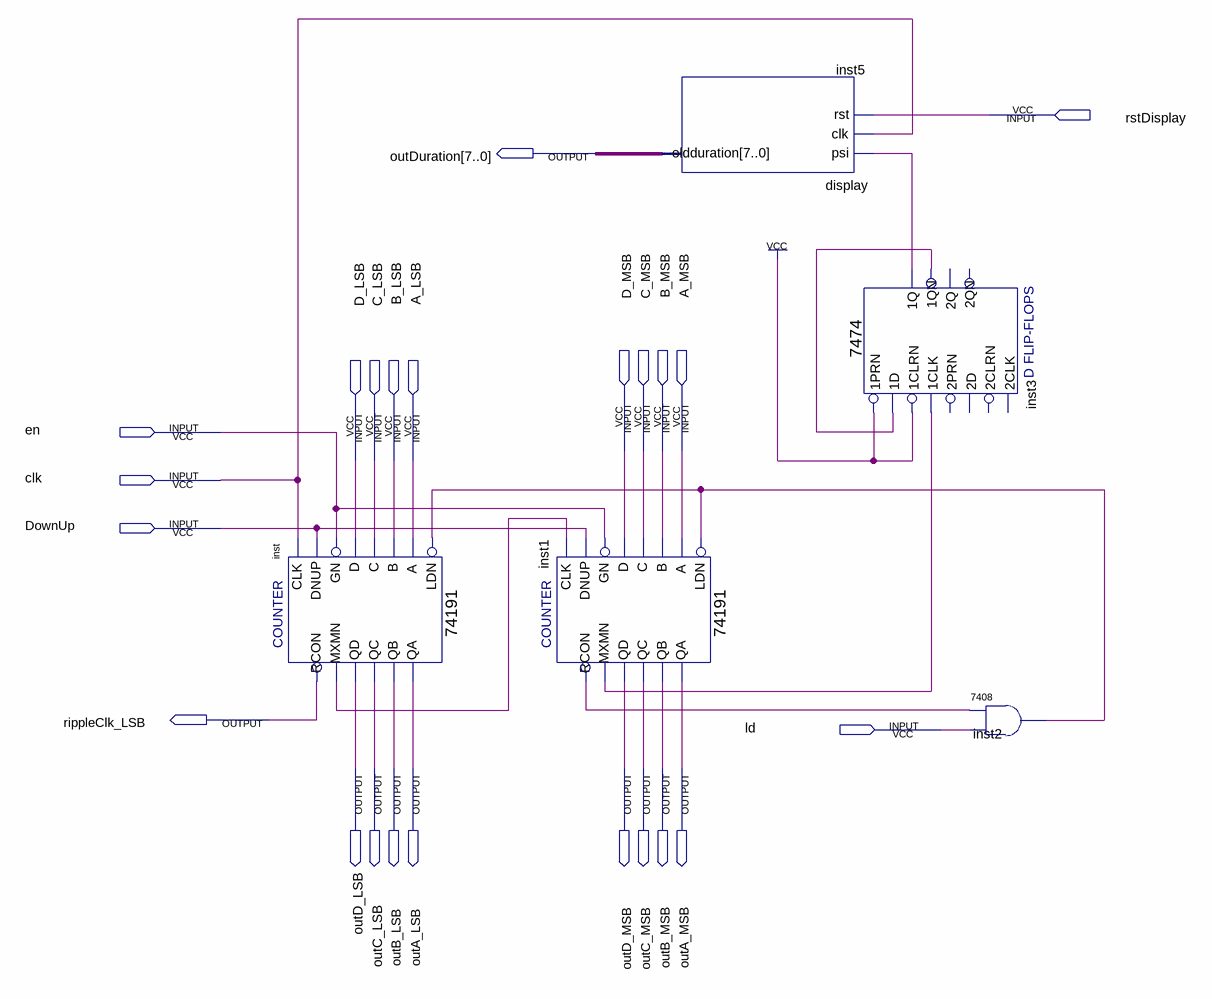
[diagram p0: schematic sheet]
// Quartus schematic Part3_4.bdf as structural Verilog: 5 symbols, 23 pins
module Part3_4 (
  input  rstDisplay,
  input  en,
  input  D_MSB,
  input  C_MSB,
  input  B_MSB,
  input  A_MSB,
  input  D_LSB,
  input  C_LSB,
  input  B_LSB,
  input  A_LSB,
  input  clk,
  input  DownUp,
  input  ld,
  output [7:0] outDuration,
  output rippleClk_LSB,
  output outD_LSB,
  output outC_LSB,
  output outB_LSB,
  output outA_LSB,
  output outD_MSB,
  output outC_MSB,
  output outB_MSB,
  output outA_MSB
);

  wire inst1_mxmn, inst1_rcon, inst2_1, inst3_1q, inst3_1qn, inst_mxmn;

  \74191  inst (
    .LDN(inst2_1), .D(D_LSB), .C(C_LSB), .B(B_LSB), .A(A_LSB), .CLK(clk), .DNUP(DownUp), .GN(en),
    .RCON(rippleClk_LSB), .MXMN(inst_mxmn), .QA(outA_LSB), .QB(outB_LSB), .QD(outD_LSB), .QC(outC_LSB));
  \74191  inst1 (
    .LDN(inst2_1), .D(D_MSB), .C(C_MSB), .B(B_MSB), .A(A_MSB), .CLK(inst_mxmn), .DNUP(DownUp), .GN(en),
    .RCON(inst1_rcon), .MXMN(inst1_mxmn), .QA(outA_MSB), .QB(outB_MSB), .QD(outD_MSB), .QC(outC_MSB));
  display inst5 (.psi(inst3_1q), .clk(clk), .rst(rstDisplay), .oldduration(outDuration));
  \7474  inst3 (
    .\1CLK (inst1_mxmn), .\1D (inst3_1qn), .\1PRN (1'b1), .\1CLRN (1'b1), .\1QN (inst3_1qn), .\1Q (inst3_1q));  // open: 2D, 2PRN, 2CLK, 2CLRN, 2Q, 2QN
  \7408  inst2 (.\3 (ld), .\2 (inst1_rcon), .\1 (inst2_1));
endmodule
